# Altium schematic sheet 3.3V_Regulator.SchDoc
size A4
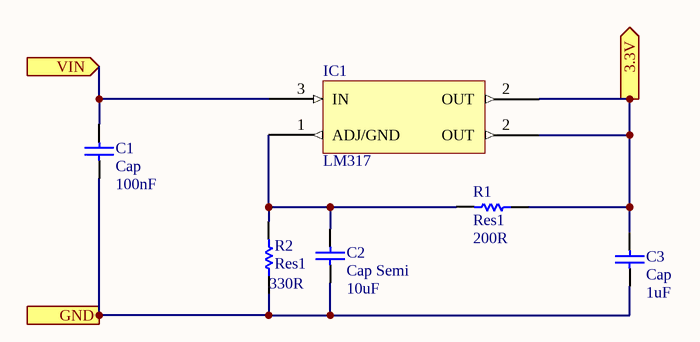
[diagram p0: 3.3V_Regulator.SchDoc]

## Parts
C1  Cap  value 100nF  [0402]
C2  Cap Semi  value 10uF  [CAP_TANT1206]
C3  Cap  value 1uF  [CAP_TANT1206]
IC1  LM317  [SOT-223]
R1  Res1  value 200R  [RES0402]
R2  Res1  value 330R  [RES0402]

## Ports
3.3V (out), GND (out), VIN (in)

## Nets
3.3V: C3.2 IC1.2(OUT) R1.1 ; port 3.3V
GND: C1.1 C2.1 C3.1 R2.1 ; port GND
VIN: C1.2 IC1.3(IN) ; port VIN
NetC2_2: C2.2 IC1.1(ADJ/GND) R1.2 R2.2

## Library data of the parts
C1 = Cap: Multilayer Ceramic Capacitors MLCC - SMD/SMT 16volts 0.1uF 20% X7R; Mfr. No: C0402C104M4RACAUTO; PackageReference: SMD-0402 (1005 metric); PackageDescription: Ceramic Capacitor; Mouser No: 80-C0402C104M4RAUTO
C2 = Cap Semi: Tantalum Capacitors - Solid SMD 16V 10uF 1206 10% ESR=3Ohms; Mfr. No: T491A106K016AT; PackageReference: SMD-1206(3216 metric); PackageDescription: Tantalum Capacitor; Mouser No: 80-T491A106K016
C3 = Cap: Tantalum Capacitors - Solid SMD 20V 1.0uF 1206 10% ESR=9Ohms; Mfr. No: T491A105K020AT; PackageReference: SMD-1206(3216 metric); PackageDescription: Tantalum Capacitor; Mouser No: 80-T491A105K020
R1 = Res1: Thick Film Resistors - SMD 1/16watt 200ohms 5%; Mfr. No: CRCW0402200RJNED; PackageReference: SMD-0402 (1005 metric); PackageDescription: Chip Resistor; Mouser No: 71-CRCW0402J-200-E3
R2 = Res1: Thick Film Resistors - SMD 0.2watt 330ohms 1% 100ppm; Mfr. No: RCS0402330RFKED; PackageReference: SMD-0402(1005 metric); PackageDescription: Chip Resistor; Mouser No: 71-RCS0402330RFKED